# Altium schematic sheet Sheet2.SchDoc: Sense Stage
size Tabloid; DocumentNumber: LM-002; Revision: F; SheetNumber: 2; SheetTotal: 2; DocumentName: LM-002
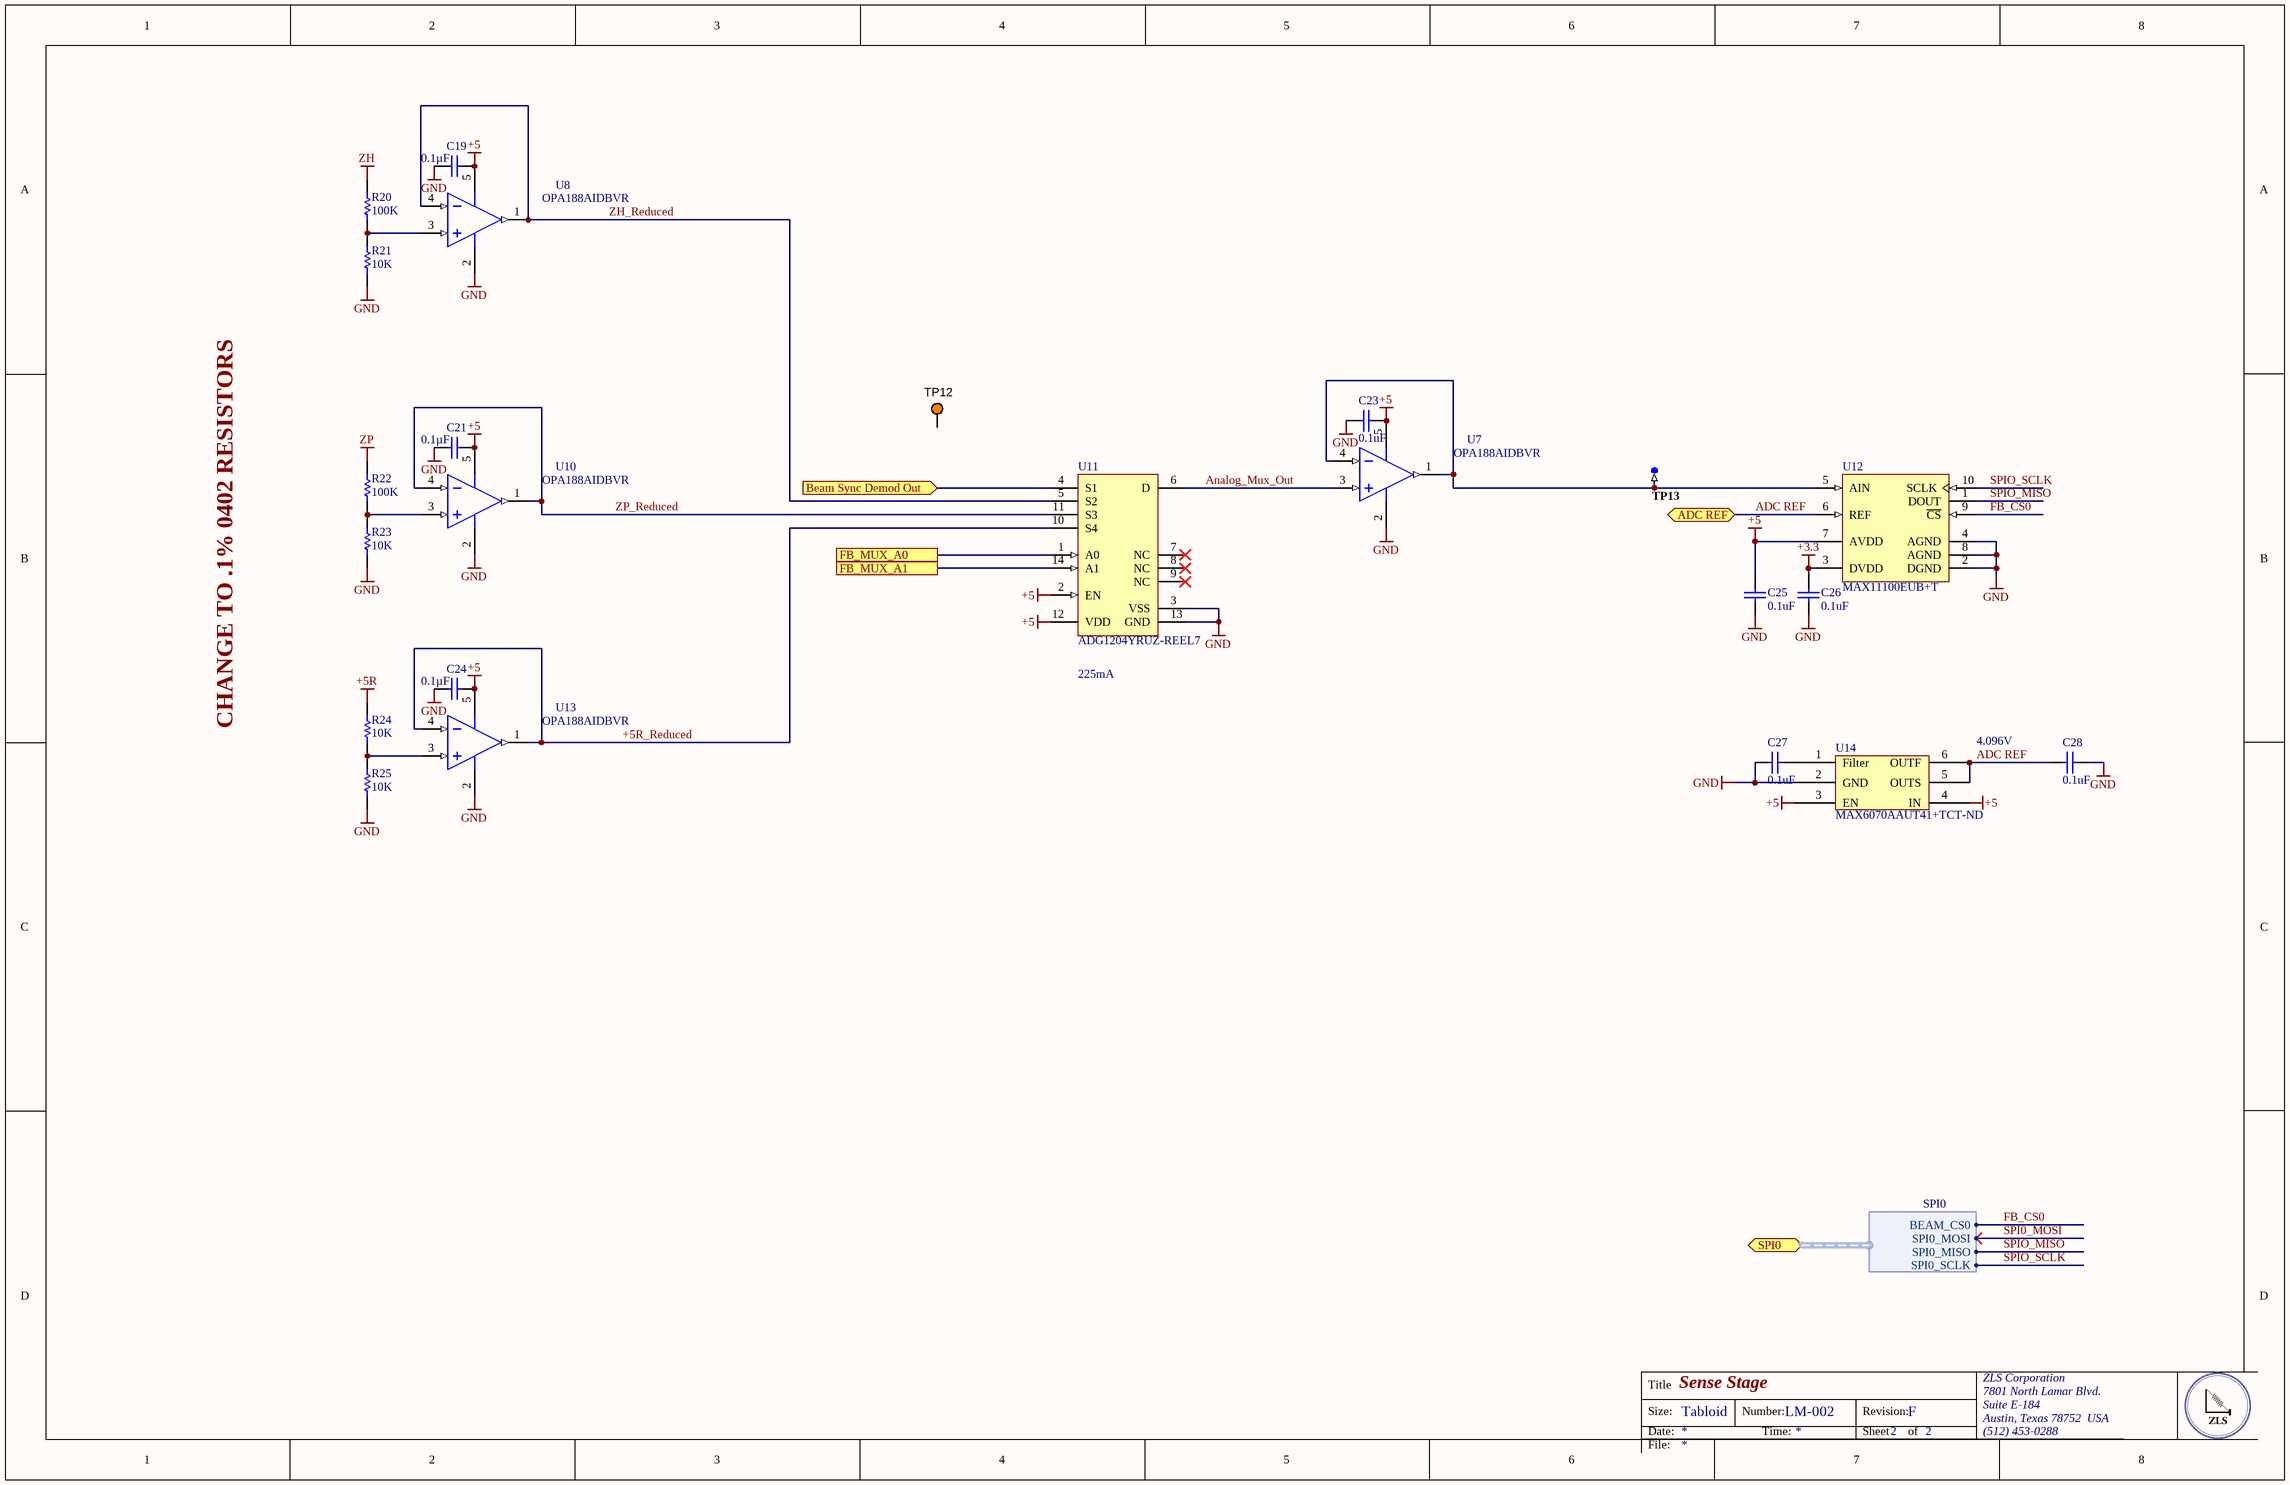
[diagram p0: Sheet2.SchDoc]

## Parts
C19  Capacitance: 0.1µF  [CAPC0805(2012)145_N]  (hidden comment: CAP CER 0.1UF 25V X7R 0805)
C21  Capacitance: 0.1µF  [CAPC0805(2012)145_N]  (hidden comment: CAP CER 0.1UF 25V X7R 0805)
C23  0.1uF  [CAPC0402(1005)60_L]
C24  Capacitance: 0.1µF  [CAPC0805(2012)145_N]  (hidden comment: CAP CER 0.1UF 25V X7R 0805)
C25  0.1uF  [CAPC0402(1005)60_L]
C26  0.1uF  [CAPC0402(1005)60_L]
C27  0.1uF  [CAPC0402(1005)60_L]
C28  0.1uF  [CAPC0402(1005)60_L]
R20  100K  [RESC0805(2012)_L]
R21  10K  [RESC0805(2012)_L]
R22  100K  [RESC0805(2012)_L]
R23  10K  [RESC0805(2012)_L]
R24  10K  [RESC0805(2012)_L]
R25  10K  [RESC0805(2012)_L]
TP12  5003  [KSTN-5003]  (value not drawn)
TP13  TP-SM-C-100  [TP-SM-C-100]  (value not drawn)  (no BOM)
U7  OPA188AIDBVR  [DBV0005A_M]
U8  OPA188AIDBVR  [DBV0005A_M]
U10  OPA188AIDBVR  [DBV0005A_M]
U11  ADG1204YRUZ-REEL7  [ADI-RU-14_L]
U12  MAX11100EUB+T  [U10+2_L]
U13  OPA188AIDBVR  [DBV0005A_M]
U14  Supplier Part Number 1: MAX6070AAUT41+TCT-ND  [SOT95P280X445-6N]  (hidden comment: MAX6070AAUT41+T)

## Ports
ADC REF, Beam Sync Demod Out (in), FB_MUX_A0, FB_MUX_A1, SPI0 (harness SPI0)

## Harnesses
SPI0: BEAM_CS0, SPI0_MOSI, SPI0_MISO, SPI0_SCLK

## Nets
+3.3: C26.2 U12.3(DVDD)
+5: C19.2 C21.2 C23.2 C24.2 C25.2 U7.5(V+) U8.5(V+) U10.5(V+) U11.2(EN) U11.12(VDD) U12.7(AVDD) U13.5(V+) U14.3(EN) U14.4(IN)
+5R: R24.2
GND: C19.1 C21.1 C23.1 C24.1 C25.1 C26.1 C27.1 C28.2 R21.1 R23.1 R25.1 U7.2(V-) U8.2(V-) U10.2(V-) U11.3(VSS) U11.13(GND) U12.2(DGND) U12.4(AGND) U12.8(AGND) U13.2(V-) U14.2(GND)
ZH: R20.2
ZP: R22.2
+5R_Reduced: U11.10(S4) U13.1(OUT) U13.4(IN-)
ADC REF: C28.1 U12.6(REF) U14.5(OUTS) U14.6(OUTF) ; port ADC REF
Analog_Mux_Out: U7.3(IN+) U11.6(D)
Beam Sync Demod Out: U11.4(S1) ; port Beam Sync Demod Out
FB_CS0: U12.9(~{CS}) ; port SPI0.BEAM_CS0
FB_MUX_A0: U11.1(A0) ; port FB_MUX_A0
FB_MUX_A1: U11.14(A1) ; port FB_MUX_A1
SPI0_MOSI: port SPI0.SPI0_MOSI
SPIO_MISO: U12.1(DOUT) ; port SPI0.SPI0_MISO
SPIO_SCLK: U12.10(SCLK) ; port SPI0.SPI0_SCLK
ZH_Reduced: U8.1(OUT) U8.4(IN-) U11.5(S2)
ZP_Reduced: U10.1(OUT) U10.4(IN-) U11.11(S3)
NetC27_2: C27.2 U14.1(Filter)
NetR20_1: R20.1 R21.2 U8.3(IN+)
NetR22_1: R22.1 R23.2 U10.3(IN+)
NetR24_1: R24.1 R25.2 U13.3(IN+)
NetTP13_1: TP13.1 U7.1(OUT) U7.4(IN-) U12.5(AIN)

Not connected (* = marked no-connect by the designer): TP12 1; U11 7(NC)* 8(NC)* 9(NC)*

## Notes on the sheet
- (near U11) 225mA
- CHANGE TO .1% 0402 RESISTORS
- 4.096V
- Title
- Size:
- Date:
- Tabloid
- Number:
- Time:
- Revision:
- Sheet
- of
- ZLS Corporation
- 7801 North Lamar Blvd.
- Suite E-184
- Austin, Texas 78752  USA
- (512) 453-0288
- File:

## Library data of the parts
C19 C21 C24 = CMP-1036-04795-1: Manufacturer: Murata Electronics North America; Manufacturer Part Number: GRM21BR71E104KA01L; Tolerance: ±10%; Supplier 1: Digi-Key; Supplier Part Number 1: 490-1673-6-ND; RoHS: RoHS Compliant; Category: Capacitors; Stock 1: 891652; Pricing 1: 1=0.2, 10=0.145, 100=0.0683, 500=0.04788, 1000=0.03964 (USD); Packaging: Digi-Reel®; Part Status: Active; Voltage - Rated: 25V; Temperature Coefficient: X7R; Operating Temperature: -55°C ~ 125°C; Features: -; Ratings: -; Applications: General Purpose; Mounting Type: Surface Mount, MLCC; Package / Case: 0805 (2012 Metric); Size / Dimension: 0.079" L x 0.049" W (2.00mm x 1.25mm); Height - Seated (Max): -; Thickness (Max): 0.053" (1.35mm); Lead Spacing: -; Lead Style: -; ComponentLink1URL: http://www.murata.com/~/media/webrenewal/support/library/catalog/products/capacitor/mlcc/c02e.ashx; ComponentLink1Description: http://www.murata.com/~/media/webrenewal/support/library/catalog/products/capacitor/mlcc/c02e.ashx
C23 C25-C28 = CMP-1034-00252-1: CAP CER 0.1UF 10V X7R 0402; Manufacturer: Murata Electronics North America; Manufacturer Part Number: GRM155R71A104KA01D; Tolerance: ±10%; Supplier 1: Digi-Key; Supplier Part Number 1: 490-6321-1-ND; RoHS: RoHS Compliant; Category: Capacitors; Stock 1: 2920395; Pricing 1: 1=0.1, 10=0.014, 100=0.0063, 500=0.00446, 1000=0.00351, 2500=0.00319, 5000=0.00293 (USD); Packaging: Cut Tape (CT); Part Status: Active; Voltage - Rated: 10V; Temperature Coefficient: X7R; Operating Temperature: -55°C ~ 125°C; Features: -; Ratings: -; Applications: General Purpose; Mounting Type: Surface Mount, MLCC; Package / Case: 0402 (1005 Metric); Size / Dimension: 0.039" L x 0.020" W (1.00mm x 0.50mm); Height - Seated (Max): -; Thickness (Max): 0.022" (0.55mm); Lead Spacing: -; ComponentLink1URL: http://www.murata.com/~/media/webrenewal/support/library/catalog/products/capacitor/mlcc/c02e.ashx?la=en-us; ComponentLink1Description: http://www.murata.com/~/media/webrenewal/support/library/catalog/products/capacitor/mlcc/c02e.ashx?la=en-us
R20 R22 = CMP-1013-00215-1: RES SMD 100K OHM 1% 1/8W 0805; Manufacturer: Vishay Dale; Manufacturer Part Number: RCA0805100KFKEA; Power (Watts): 0.125W, 1/8W; Temperature Coefficient: ±100ppm/°C; Supplier 1: Digi-Key; Supplier Part Number 1: 541-2230-1-ND; RoHS: RoHS Compliant; Category: Resistors; Stock 1: 18704; Pricing 1: 1=0.1, 10=0.079, 100=0.0303, 1000=0.01331, 2500=0.0115 (USD); Packaging: Cut Tape (CT); Part Status: Active; Tolerance: ±1%; Composition: Thick Film; Features: Anti-Sulfur, Automotive AEC-Q200; Operating Temperature: -55°C ~ 155°C; Package / Case: 0805 (2012 Metric); Supplier Device Package: 0805; Size / Dimension: 0.079" L x 0.049" W (2.01mm x 1.25mm); Height - Seated (Max): 0.020" (0.50mm); Failure Rate: -; ComponentLink1URL: http://www.vishay.com/docs/20037/rcae3.pdf; ComponentLink1Description: http://www.vishay.com/docs/20037/rcae3.pdf
R21 R23-R25 = CMP-1013-00215-1: RES SMD 10K OHM 1% 1/8W 0805; Manufacturer: Vishay Dale; Manufacturer Part Number: CRCW080510K0FKEA; Power (Watts): 0.125W, 1/8W; Temperature Coefficient: ±100ppm/°C; Supplier 1: Digi-Key; Supplier Part Number 1: 541-10.0KCCT-ND; RoHS: RoHS Compliant; Category: Resistors; Stock 1: 1104982; Pricing 1: 1=0.1, 10=0.055, 100=0.0223, 1000=0.01003, 2500=0.0087 (USD); Packaging: Cut Tape (CT); Part Status: Active; Tolerance: ±1%; Composition: Thick Film; Features: Automotive AEC-Q200; Operating Temperature: -55°C ~ 155°C; Package / Case: 0805 (2012 Metric); Supplier Device Package: 0805; Size / Dimension: 0.079" L x 0.049" W (2.00mm x 1.25mm); Height - Seated (Max): 0.020" (0.50mm); Failure Rate: -; ComponentLink1URL: http://www.vishay.com/docs/20035/dcrcwe3.pdf; ComponentLink1Description: http://www.vishay.com/docs/20035/dcrcwe3.pdf
TP12 = CMP-1672-00009-1: Test Point, Orange, 1-Pin THD, RoHS; Peak Reverse Current: 600 uA; Forward Current: 3 A; Max Surge Current: 80 A; Forward Voltage: 1.08 V; Max Operating Temperature: 150 degC; PackageReference: 5003; Pins: 2; ComponentLink2URL: http://keyelco.com/userAssets/file/M65p56.pdf; PackageDescription: 1-Pin Through Hole Device, Dia 2.54 mm; Weight: 0.01 lb; Diameter: 5.3 mm; Mount: Through Hole; Package Quantity: 500; Packaging: Bulk; Min Operating Temperature: -65 degC; ComponentLink1Description: Manufacturer URL; Height: 0.25 inch; ComponentLink1URL: http://www.keyelco.com/; ComponentLink2Description: Datasheet; Width: 0.25 inch; REACH SVHC: No SVHC; RoHSCompliant: true; Radiation Hardening: No; Length: 9.5 mm; DatasheetVersion: Jun-15
TP13 = CMP-0484-00002-2: Test Point, Surface Mount, Circular, Pad Diameter 1 mm; Manufacturer: No Vendor; PartNumber: TP-SM-C-100
U7 = CMP-0809-00005-2: Precision, Low Noise, Rail-to-Rail Output, Zero-Drift Operational Amplifier, 4 to 36 V, -40 to 125 degC, 5-pin SOT23 (DBV5), Green (RoHS & no Sb/Br); Manufacturer: Texas Instruments; Unity Gain Bandwidth Product: 2MHz; Max Supply Voltage: 36V; Min Supply Voltage: 4V; Min Dual Supply Voltage: 2V; Max Dual Supply Voltage: 18V; Nominal Supply Current: 510uA; Common Mode Rejection Ratio: 120dB; Number of Channels: 1; Slew Rate: 0.8V/µs; Input Bias Current: 160pA; Input Offset Voltage (Vos): 6uV; Operating Supply Current: 450uA; Output Current per Channel: 18mA; Voltage Gain: 136dB; Input Voltage Noise Density: 8.8nV/sqrt Hz; Power Supply Rejection Ratio (PSRR): 142dB; Supplier 1: Arrow; Supplier Part Number 1: OPA188AIDBVR; Manufacturer Part Number: OPA188AIDBVR; Stock 1: 95; Pricing 1: 1=2.1871, 10=1.943, 25=1.9086, 100=1.5565, 250=1.5371, 500=1.3168, 1000=1.2243 (USD); Case/Package: SOT-23-5; Number of Pins: 5; Contact Plating: Nickel,Gold; Min Operating Temperature: -40°C; Max Operating Temperature: 125°C; Packaging: Tape and Reel; Package Quantity: 3000; Nominal Gain Bandwidth Product: 2MHz; Number of Circuits: 1; Gain Bandwidth Product: 2MHz; Number of Elements: 1; Lead Free: Lead Free; ComponentLink1URL: https://datasheet.ciiva.com/24017/opa188-372986-24017253.pdf; ComponentLink1Description: https://datasheet.ciiva.com/24017/opa188-372986-24017253.pdf; ComponentLink2URL: https://datasheet.ciiva.com/18622/opa188-18622375.pdf; ComponentLink2Description: https://datasheet.ciiva.com/18622/opa188-18622375.pdf
U8 U10 U13 = CMP-0809-00005-2: Precision, Low Noise, Rail-to-Rail Output, Zero-Drift Operational Amplifier, 4 to 36 V, -40 to 125 degC, 5-pin SOT23 (DBV5), Green (RoHS & no Sb/Br); Manufacturer: Texas Instruments; Total Supply Voltage(Min)(+5V is 5, +/-5V is 10): 4; Offset Drift(Typ)(uV/C): 0.03; Rating: Catalog; SubFamily: Zero Drift Precision Amplifier; GBW(Typ)(MHz): 2; Slew Rate(Typ)(V/us): 0.8; Number of Channels: 1; CMRR(Min)(dB): 120; Iq per channel(Max)(mA): 0.51; Total Supply Voltage(Max)(+5V is 5, +/-5V is 10): 36; PartNumber: OPA188AIDBVR; ComponentLink2Description: Datasheet; ComponentLink2URL: http://www.ti.com/lit/ds/symlink/opa188.pdf; ComponentLink1Description: Manufacturer URL; Mounting Technology: Surface Mount; Eco-Plan: Green (RoHS & no Sb/Br); ComponentLink1URL: http://www.ti.com/; PackageVersion: 4073253-4/K, 03/2006; DatasheetVersion: SBOS642A; ComponentLink3Description: Package Specification; PackageReference: DBV0005A; ComponentLink3URL: http://www.ti.com/litv/pdf/mpds018i; PackageDescription: 5-Pin Plastic Small Outline, Body 1.6 x 2.9 mm, Pitch 0.95 mm; Code_JEDEC: MO-178
U11 = CMP-0793-00109-1: Low Capacitance, Low Charge Injection, +/-15 V / +12 V, 4:1 iCMOS Multiplexer, 120 Ohm Ron, 14-pin SOP (RU-14), Reel; Manufacturer: Maxim Integrated; Manufacturer Part Number: MAX11100EUB+; Number of Bits: 16; Sampling Rate (Per Second): 200k; Number of Inputs: 1; Input Type: Single Ended; Data Interface: SPI; Configuration: S/H-ADC; Ratio - S/H:ADC: 1:1; Architecture: SAR; Reference Type: External; Voltage - Supply, Analog: 5V; Voltage - Supply, Digital: 2.7 V ~ 5.25 V; Supplier 1: Digi-Key; Supplier Part Number 1: MAX11100EUB+-ND; RoHS: RoHS Compliant; Category: Integrated Circuits (ICs); Stock 1: 927; Pricing 1: 1=5.98, 10=5.855 (USD); Packaging: Tube; Part Status: Active; Features: -; Operating Temperature: -40°C ~ 85°C; Package / Case: 10-TFSOP, 10-MSOP (0.118", 3.00mm Width); Supplier Device Package: 10-uMAX; Base Part Number: MAX11100; ComponentLink1URL: https://datasheets.maximintegrated.com/en/ds/MAX11100.pdf; ComponentLink1Description: https://datasheets.maximintegrated.com/en/ds/MAX11100.pdf
U12 = CMP-0249-00017-1: 16-Bit, +5V, 200ksps ADC with 10uA Shutdown, 10-Pin uMAX, -40°C to +85°C, Pb-Free, Tape and Reel; Manufacturer: Maxim Integrated; Number of Bits: 16; Sampling Rate (Per Second): 200k; Number of Inputs: 1; Input Type: Single Ended; Data Interface: SPI; Configuration: S/H-ADC; Ratio - S/H:ADC: 1:1; Architecture: SAR; Reference Type: External; Voltage - Supply, Analog: 5V; Voltage - Supply, Digital: 2.7 V ~ 5.25 V; Supplier 1: Digi-Key; Supplier Part Number 1: MAX11100EUB+-ND; Manufacturer Part Number: MAX11100EUB+; RoHS: RoHS Compliant; Category: Integrated Circuits (ICs); Stock 1: 927; Pricing 1: 1=5.98, 10=5.855 (USD); Packaging: Tube; Part Status: Active; Features: -; Operating Temperature: -40°C ~ 85°C; Package / Case: 10-TFSOP, 10-MSOP (0.118", 3.00mm Width); Supplier Device Package: 10-uMAX; Base Part Number: MAX11100; ComponentLink1URL: https://datasheets.maximintegrated.com/en/ds/MAX11100.pdf; ComponentLink1Description: https://datasheets.maximintegrated.com/en/ds/MAX11100.pdf
U14 = MAX6070AAUT41+T: IC VREF SERIES 4.096V SOT23; Manufacturer: Maxim Integrated; Output Type: Fixed; Tolerance: ±0.04%; Temperature Coefficient: 6ppm/°C; Noise - 0.1Hz to 10Hz: 9.6µVp-p; Noise - 10Hz to 10kHz: 9µVrms; Voltage - Input: 4.3 V ~ 5.5 V; Current - Supply: 350µA; Supplier 1: Digi-Key; Manufacturer Part Number: MAX6070AAUT41+T; RoHS: RoHS Compliant; Category: Integrated Circuits (ICs); Stock 1: 2623; Pricing 1: 1=3.41, 10=3.213, 25=2.5704, 50=2.4418, 100=2.2491, 250=2.13344, 500=2.05634 (USD); Packaging: Cut Tape (CT); Part Status: Active; Reference Type: Series; Voltage - Output (Min/Fixed): 4.096V; Operating Temperature: -40°C ~ 125°C (TA); Mounting Type: Surface Mount; Package / Case: SOT-23-6; Supplier Device Package: SOT-23-6; ComponentLink1URL: https://datasheets.maximintegrated.com/en/ds/MAX6070-MAX6071.pdf; ComponentLink1Description: https://datasheets.maximintegrated.com/en/ds/MAX6070-MAX6071.pdf